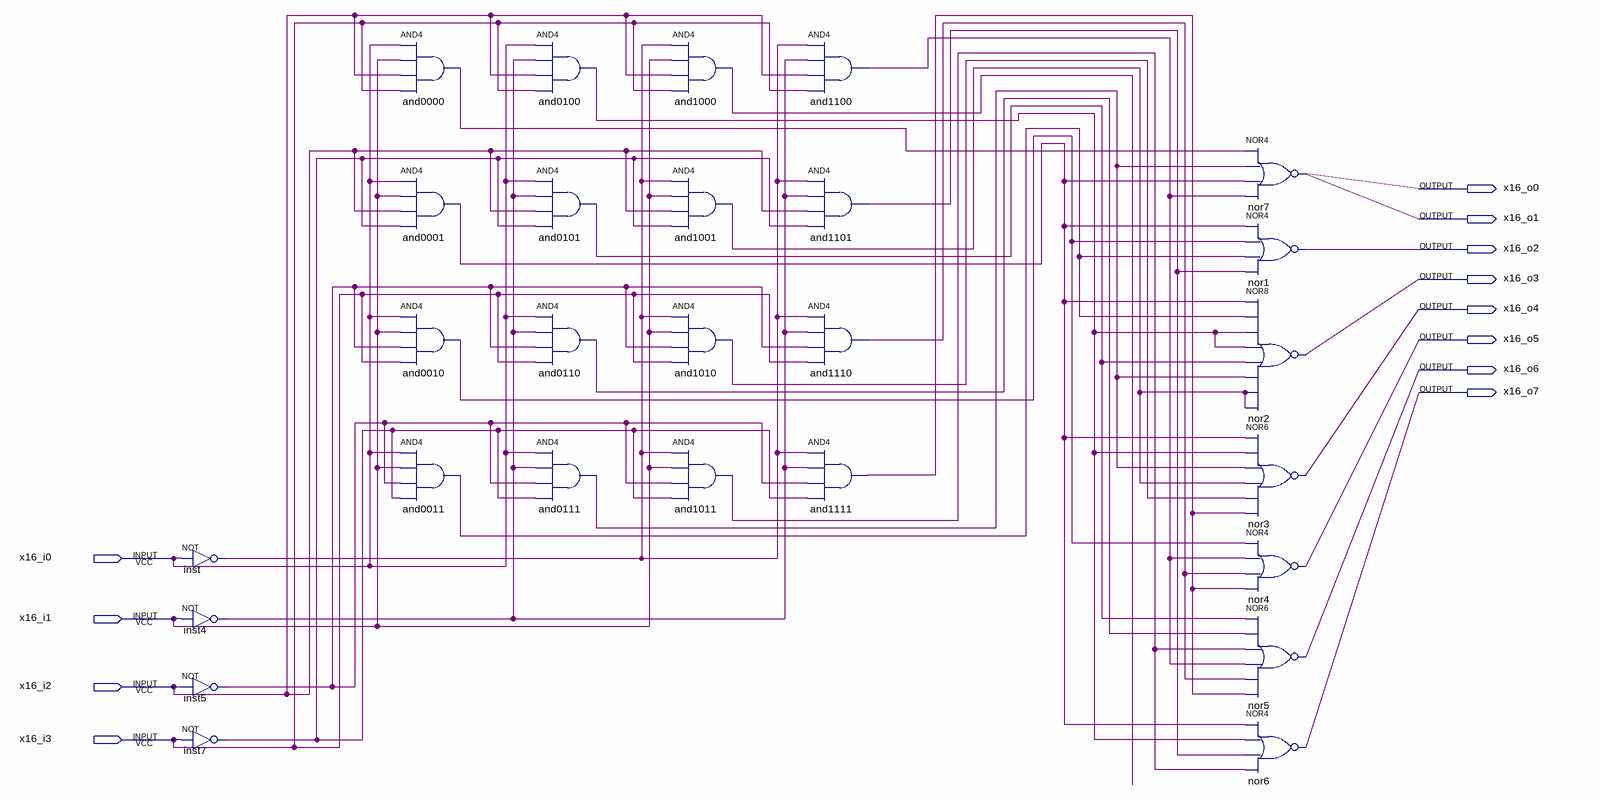
[diagram p0: schematic sheet]
// Quartus schematic x16_lib.bdf as structural Verilog: 27 symbols, 12 pins
module x16_lib (
  input  x16_i0,
  input  x16_i1,
  input  x16_i2,
  input  x16_i3,
  output x16_o0,
  output x16_o1,
  output x16_o2,
  output x16_o3,
  output x16_o4,
  output x16_o5,
  output x16_o6,
  output x16_o7
);

  wire and0000_out, and0001_out, and0010_out, and0011_out, and0100_out, and0101_out, and0110_out,
       and0111_out, and1000_out, and1001_out, and1010_out, and1011_out, and1100_out, and1101_out,
       and1110_out, and1111_out, inst4_out, inst5_out, inst7_out, inst_out;

  not inst (inst_out, x16_i0);
  not inst4 (inst4_out, x16_i1);
  not inst5 (inst5_out, x16_i2);
  not inst7 (inst7_out, x16_i3);
  and and0000 (and0000_out, x16_i0, x16_i1, x16_i2, x16_i3);
  and and0001 (and0001_out, x16_i0, x16_i1, x16_i2, inst7_out);
  and and0010 (and0010_out, x16_i0, x16_i1, inst5_out, x16_i3);
  and and0011 (and0011_out, x16_i0, x16_i1, inst5_out, inst7_out);
  and and0100 (and0100_out, x16_i0, inst4_out, x16_i2, x16_i3);
  and and0101 (and0101_out, x16_i0, inst4_out, x16_i2, inst7_out);
  and and0110 (and0110_out, x16_i0, inst4_out, inst5_out, x16_i3);
  and and0111 (and0111_out, x16_i0, inst4_out, inst5_out, inst7_out);
  and and1000 (and1000_out, inst_out, x16_i1, x16_i2, x16_i3);
  and and1001 (and1001_out, inst_out, x16_i1, x16_i2, inst7_out);
  and and1010 (and1010_out, inst_out, x16_i1, inst5_out, x16_i3);
  and and1011 (and1011_out, inst_out, x16_i1, inst5_out, inst7_out);
  and and1100 (and1100_out, inst_out, inst4_out, x16_i2, x16_i3);
  and and1101 (and1101_out, inst_out, inst4_out, x16_i2, inst7_out);
  and and1110 (and1110_out, inst_out, inst4_out, inst5_out, x16_i3);
  and and1111 (and1111_out, inst_out, inst4_out, inst5_out, inst7_out);
  nor nor7 (x16_o0, and0000_out, and0111_out, and0001_out, and1100_out);
  nor nor1 (x16_o2, and0001_out, and0010_out, and0011_out, and1101_out);
  nor nor2 (x16_o3, and0001_out, and0011_out, and0100_out, and0100_out, and0101_out, and0111_out, and1001_out, and1001_out);
  nor nor3 (x16_o4, and0001_out, and0100_out, and0111_out, and1001_out, and1010_out, and1111_out);
  nor nor4 (x16_o5, and0010_out, and1100_out, and1110_out, and1111_out);
  nor nor5 (x16_o6, and0101_out, and0110_out, and1011_out, and1100_out, and1110_out, and1111_out);
  nor nor6 (x16_o7, and0001_out, and0100_out, and1101_out, and1011_out);

  assign x16_o1 = x16_o0;
endmodule
